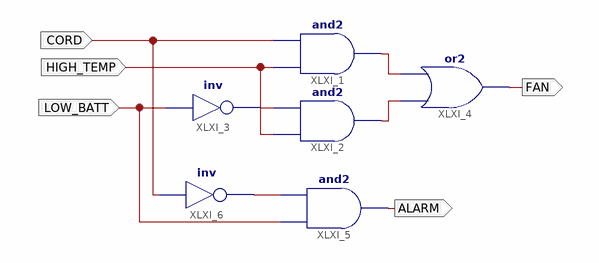
[diagram p0: schematic sheet 1]
// Xilinx ISE schematic Alarm_Fan.sch (spartan3e) as structural Verilog: 6 symbols, 5 ports
module Alarm_Fan (
  input  LOW_BATT,
  input  HIGH_TEMP,
  input  CORD,
  output FAN,
  output ALARM
);

  wire XLXN_1, XLXN_2, XLXN_4, XLXN_5;

  and XLXI_1 (XLXN_4, HIGH_TEMP, CORD);
  and XLXI_2 (XLXN_5, HIGH_TEMP, XLXN_1);
  not XLXI_3 (XLXN_1, LOW_BATT);
  or XLXI_4 (FAN, XLXN_5, XLXN_4);
  and XLXI_5 (ALARM, LOW_BATT, XLXN_2);
  not XLXI_6 (XLXN_2, CORD);
endmodule
